# Altium project SUBBOARD-voltage_sensors.PrjPcb (part 2 of 2)
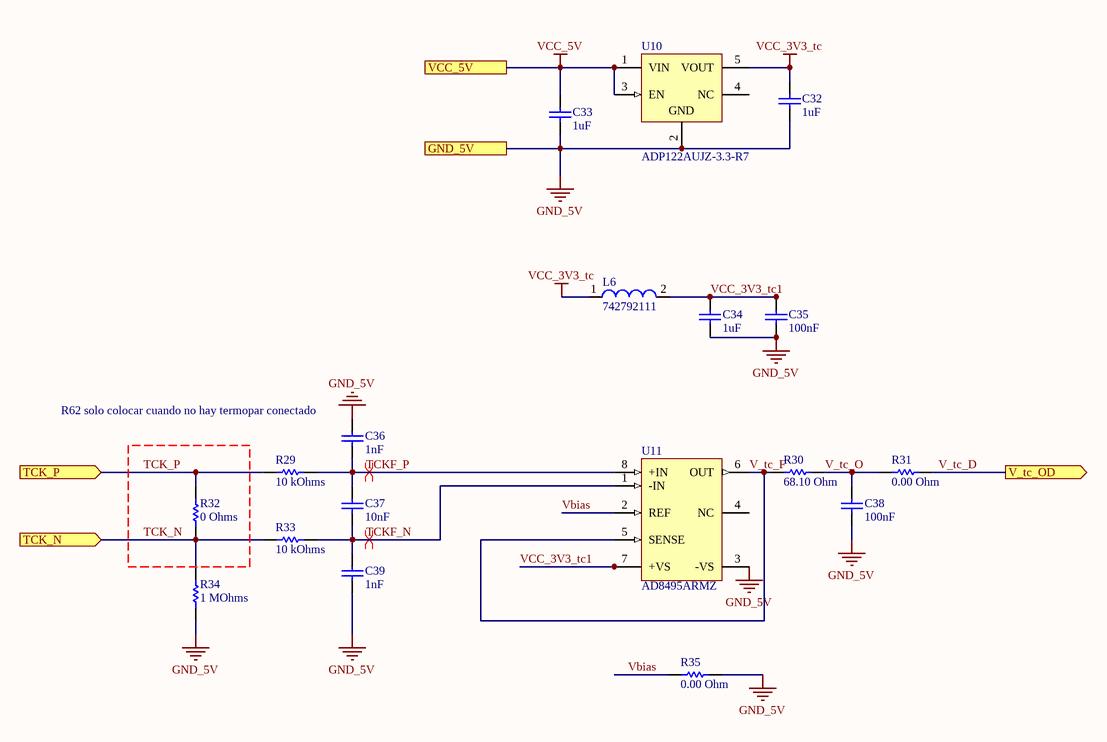
[diagram p5: thermocouple.SchDoc]

## Nets that join several sheets
GND: SUBBOARD-voltage_sensors (45 pins), A (14 pins), B (14 pins), MCU_v2 (48 pins), thermocouple (11 pins)
VCC_1V65L: A (11 pins), B (11 pins)
VCC_5V: SUBBOARD-voltage_sensors (20 pins), A (6 pins), B (6 pins), MCU_v2 (17 pins), thermocouple (C33.2 U10.1 U10.3)
AO0: MCU_v2 (J15.30 J16.21), thermocouple (R31.1)
AO1: A (R16A.1), MCU_v2 (J15.27 J16.71)
AO2: SUBBOARD-voltage_sensors (J3.5), MCU_v2 (J15.28 J16.19)
AO3: A (R8A.1), MCU_v2 (J15.25 J16.69)
AO4: SUBBOARD-voltage_sensors (J7.5), MCU_v2 (J15.26 J16.17)
AO5: A (R18A.1), MCU_v2 (J15.23 J16.67)
AO6: SUBBOARD-voltage_sensors (J11.5), MCU_v2 (J15.24 J16.15)
AO7: A (R10A.1), MCU_v2 (J15.21 J16.65)
AO8: SUBBOARD-voltage_sensors (J14.5), MCU_v2 (J15.20 J16.13)
AO9: B (R16B.1), MCU_v2 (J15.17 J16.63)
AO11: B (R8B.1), MCU_v2 (J15.15 J16.61)
AO12: B (R10B.1), MCU_v2 (J15.14 J16.9)
AO14: B (R18B.1), MCU_v2 (J15.12 J16.7)
Ch1_N: A (C10A.1 R6A.2 U5A.2), C1 (R28A.1)
Ch1_N: C5 (R28E.1), B (C10B.1 R6B.2 U5B.2)
Ch1_P: A (C14A.1 R12A.1 U5A.3), C1 (R24A.1)
Ch1_P: C5 (R24E.1), B (C14B.1 R12B.1 U5B.3)
Ch2_N: A (C16A.1 R14A.2 U5A.6), C2 (R28B.1)
Ch2_N: C6 (R28F.1), B (C16B.1 R14B.2 U5B.6)
Ch2_P: A (C20A.1 R20A.1 U5A.5), C2 (R24B.1)
Ch2_P: C6 (R24F.1), B (C20B.1 R20B.1 U5B.5)
Ch3_N: A (C9A.1 R5A.2 U5A.11), C3 (R28C.1)
Ch3_N: C7 (R28G.1), B (C9B.1 R5B.2 U5B.11)
Ch3_P: A (C13A.1 R11A.1 U5A.12), C3 (R24C.1)
Ch3_P: C7 (R24G.1), B (C13B.1 R11B.1 U5B.12)
Ch4_N: A (C15A.1 R13A.2 U5A.15), C4 (R28D.1)
Ch4_N: C8 (R28H.1), B (C15B.1 R13B.2 U5B.15)
Ch4_P: A (C19A.1 R19A.1 U5A.14), C4 (R24D.1)
Ch4_P: C8 (R24H.1), B (C19B.1 R19B.1 U5B.14)
ENA: SUBBOARD-voltage_sensors (J1.4 J4.4 J10.4), MCU_v2 (P11.2)
FLTOC: SUBBOARD-voltage_sensors (J3.7 J7.7 J11.7 J14.7), MCU_v2 (P9.2)
GON1: SUBBOARD-voltage_sensors (J5.3 J8.3 J12.3), MCU_v2 (P12.2)
Gon1: SUBBOARD-voltage_sensors (J6.3 J9.3 J13.3), MCU_v2 (P13.2)
Neutro: C5 (R25E.2), C6 (R25F.2), C7 (R25G.2), C8 (R25H.2)
PWM_H1: SUBBOARD-voltage_sensors (J1.1), MCU_v2 (P5.2)
PWM_H2: SUBBOARD-voltage_sensors (J4.1), MCU_v2 (P3.2)
PWM_H3: SUBBOARD-voltage_sensors (J10.1), MCU_v2 (P7.2)
PWM_L1: SUBBOARD-voltage_sensors (J1.3), MCU_v2 (P6.2)
PWM_L2: SUBBOARD-voltage_sensors (J4.3), MCU_v2 (P4.2)
PWM_L3: SUBBOARD-voltage_sensors (J10.3), MCU_v2 (P8.2)
RSTOC: SUBBOARD-voltage_sensors (J3.1 J7.1 J11.1 J14.1), MCU_v2 (P10.2)
TCK_N: SUBBOARD-voltage_sensors (J2.4), thermocouple (R32.1 R33.2 R34.2)
TCK_P: SUBBOARD-voltage_sensors (J2.3), thermocouple (R29.2 R32.2)